# Altium schematic sheet XC2C128.SchDoc: FIT_PM12 board
size 420 x 297 mm; CheckedBy: G.Kasprowicz; Author: INR Moscow; CompanyName: WUT ISE; DrawnBy: M.Podgórski; Organization: WUT ISE; Address1: PW ISE; Address2: Nowowiejska 15/19 00-665 Warsaw; Address3: gkasprow@gmail.com; DocumentNumber: 7; Revision: 2; SheetNumber: 10; SheetTotal: 34; ModifiedBy: -; CheckedDate: -; Title2: CPLD; DivGrp: WUT ISE; Designer: INR RAS; ModifiedDate: -; ProjectName: Sensor Box
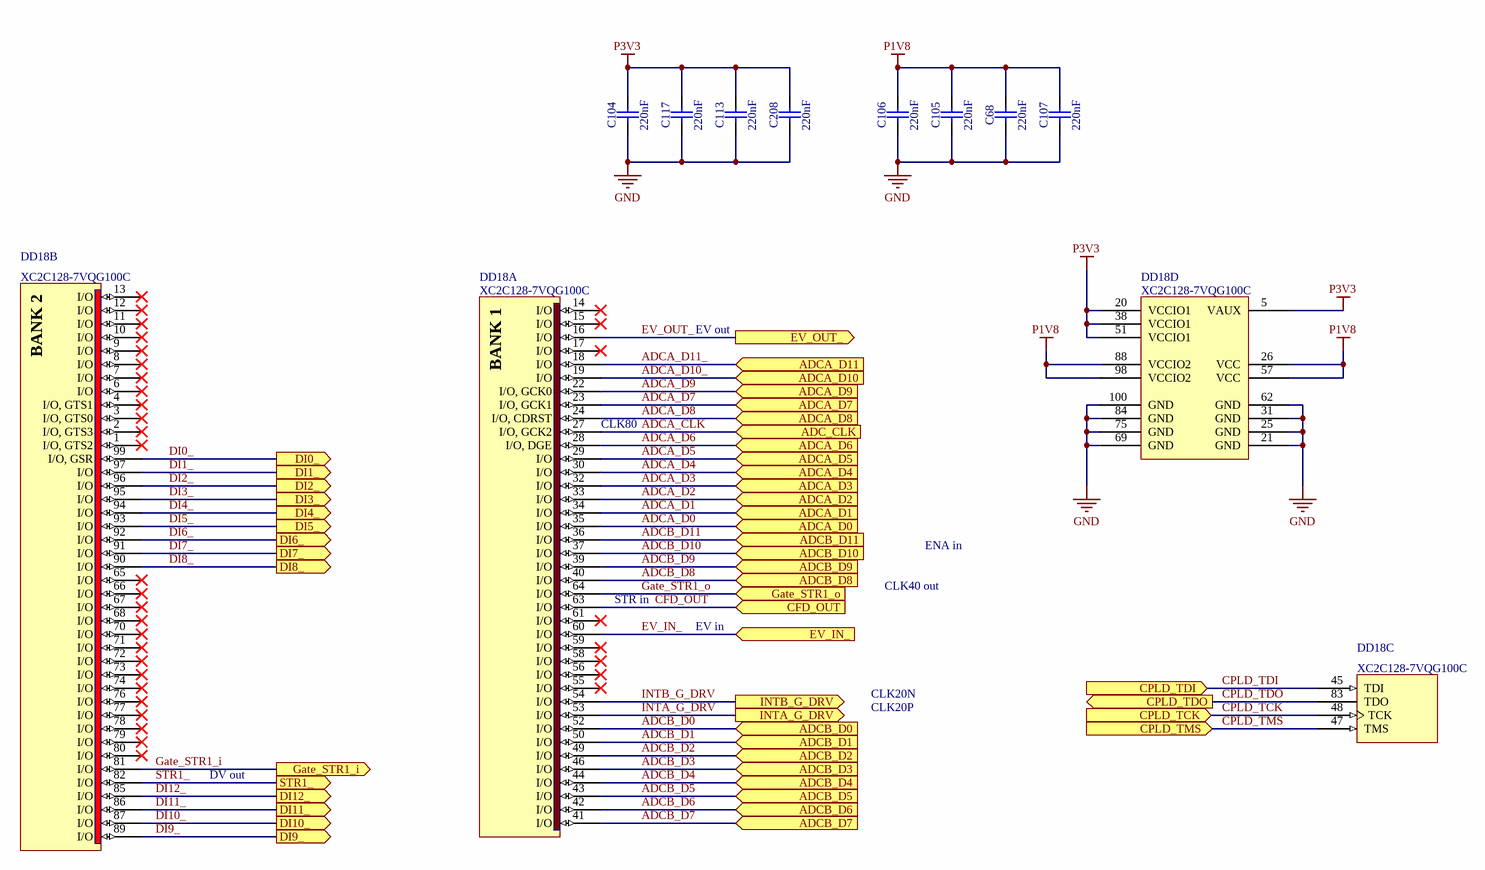
[diagram p0: XC2C128.SchDoc]

## Parts
C68  220nF  [CAPC2012X135N]
C104  220nF  [CAPC2012X135N]
C105  220nF  [CAPC2012X135N]
C106  220nF  [CAPC2012X135N]
C107  220nF  [CAPC2012X135N]
C113  220nF  [CAPC2012X135N]
C117  220nF  [CAPC2012X135N]
C208  220nF  [CAPC2012X135N]
DD18  XC2C128-7VQG100C  [QFP50P1600X1600X120-100N]  (parts A,B,C,D of 4)

## Ports
ADC_CLK (in), ADCA_D0 (in), ADCA_D1 (in), ADCA_D2 (in), ADCA_D3 (in), ADCA_D4 (in), ADCA_D5 (in), ADCA_D6 (in), ADCA_D7 (in), ADCA_D8 (in), ADCA_D9 (in), ADCA_D10 (in), ADCA_D11 (in), ADCB_D0 (in), ADCB_D1 (in), ADCB_D2 (in), ADCB_D3 (in), ADCB_D4 (in), ADCB_D5 (in), ADCB_D6 (in), ADCB_D7 (in), ADCB_D8 (in), ADCB_D9 (in), ADCB_D10 (in), ADCB_D11 (in), CFD_OUT (in), CPLD_TCK (in), CPLD_TDI (in), CPLD_TDO (out), CPLD_TMS (in), DI0_ (out), DI1_ (out), DI2_ (out), DI3_ (out), DI4_ (out), DI5_ (out), DI6_ (out), DI7_ (out), DI8_ (out), DI9_ (out), DI10_ (out), DI11_ (out), DI12_ (out), EV_IN_ (in), EV_OUT_ (out), Gate_STR1_i (out), Gate_STR1_o (in), INTA_G_DRV (out), INTB_G_DRV (out), STR1_ (out)

## Nets
GND: C68.1 C104.1 C105.1 C106.1 C107.1 C113.1 C117.1 C208.1 DD18.21(GND) DD18.25(GND) DD18.31(GND) DD18.62(GND) DD18.69(GND) DD18.75(GND) DD18.84(GND) DD18.100(GND)
P1V8: C68.2 C105.2 C106.2 C107.2 DD18.26(VCC) DD18.57(VCC) DD18.88(VCCIO2) DD18.98(VCCIO2)
P3V3: C104.2 C113.2 C117.2 C208.2 DD18.5(VAUX) DD18.20(VCCIO1) DD18.38(VCCIO1) DD18.51(VCCIO1)
ADCA_CLK: DD18.27(I/O,_GCK2) ; port ADC_CLK
ADCA_D0: DD18.35(I/O) ; port ADCA_D0
ADCA_D1: DD18.34(I/O) ; port ADCA_D1
ADCA_D2: DD18.33(I/O) ; port ADCA_D2
ADCA_D3: DD18.32(I/O) ; port ADCA_D3
ADCA_D4: DD18.30(I/O) ; port ADCA_D4
ADCA_D5: DD18.29(I/O) ; port ADCA_D5
ADCA_D6: DD18.28(I/O,_DGE) ; port ADCA_D6
ADCA_D7: DD18.23(I/O,_GCK1) ; port ADCA_D7
ADCA_D8: DD18.24(I/O,_CDRST) ; port ADCA_D8
ADCA_D9: DD18.22(I/O,_GCK0) ; port ADCA_D9
ADCA_D10_: DD18.19(I/O) ; port ADCA_D10
ADCA_D11_: DD18.18(I/O) ; port ADCA_D11
ADCB_D0: DD18.52(I/O) ; port ADCB_D0
ADCB_D1: DD18.50(I/O) ; port ADCB_D1
ADCB_D2: DD18.49(I/O) ; port ADCB_D2
ADCB_D3: DD18.46(I/O) ; port ADCB_D3
ADCB_D4: DD18.44(I/O) ; port ADCB_D4
ADCB_D5: DD18.43(I/O) ; port ADCB_D5
ADCB_D6: DD18.42(I/O) ; port ADCB_D6
ADCB_D7: DD18.41(I/O) ; port ADCB_D7
ADCB_D8: DD18.40(I/O) ; port ADCB_D8
ADCB_D9: DD18.39(I/O) ; port ADCB_D9
ADCB_D10: DD18.37(I/O) ; port ADCB_D10
ADCB_D11: DD18.36(I/O) ; port ADCB_D11
CFD_OUT: DD18.63(I/O) ; port CFD_OUT
CPLD_TCK: DD18.48(TCK) ; port CPLD_TCK
CPLD_TDI: DD18.45(TDI) ; port CPLD_TDI
CPLD_TDO: DD18.83(TDO) ; port CPLD_TDO
CPLD_TMS: DD18.47(TMS) ; port CPLD_TMS
DI0_: DD18.99(I/O,_GSR) ; port DI0_
DI1_: DD18.97(I/O) ; port DI1_
DI2_: DD18.96(I/O) ; port DI2_
DI3_: DD18.95(I/O) ; port DI3_
DI4_: DD18.94(I/O) ; port DI4_
DI5_: DD18.93(I/O) ; port DI5_
DI6_: DD18.92(I/O) ; port DI6_
DI7_: DD18.91(I/O) ; port DI7_
DI8_: DD18.90(I/O) ; port DI8_
DI9_: DD18.89(I/O) ; port DI9_
DI10_: DD18.87(I/O) ; port DI10_
DI11_: DD18.86(I/O) ; port DI11_
DI12_: DD18.85(I/O) ; port DI12_
EV_IN_: DD18.60(I/O) ; port EV_IN_
EV_OUT_: DD18.16(I/O) ; port EV_OUT_
Gate_STR1_i: DD18.81(I/O) ; port Gate_STR1_i
Gate_STR1_o: DD18.64(I/O) ; port Gate_STR1_o
INTA_G_DRV: DD18.53(I/O) ; port INTA_G_DRV
INTB_G_DRV: DD18.54(I/O) ; port INTB_G_DRV
STR1_: DD18.82(I/O) ; port STR1_

Not connected (* = marked no-connect by the designer): DD18 1(I/O,_GTS2)* 2(I/O,_GTS3)* 3(I/O,_GTS0)* 4(I/O,_GTS1)* 6(I/O)* 7(I/O)* 8(I/O)* 9(I/O)* 10(I/O)* 11(I/O)* 12(I/O)* 13(I/O)* 14(I/O)* 15(I/O)* 17(I/O)* 55(I/O)* 56(I/O)* 58(I/O)* 59(I/O)* 61(I/O)* 65(I/O)* 66(I/O)* 67(I/O)* 68(I/O)* 70(I/O)* 71(I/O)* 72(I/O)* 73(I/O)* 74(I/O)* 76(I/O)* 77(I/O)* 78(I/O)* 79(I/O)* 80(I/O)*

## Notes on the sheet
- EV out
- (near DD18) CLK80
- ENA in
- STR in
- EV in
- CLK40 out
- CLK20N
- DV out
- CLK20P
- Project/Equipment
- Document
- Designer
- Drawn by
- Check.by
- Copyright WUT ISE 2024.
  This documentation describes Open Hardware and is licensed under the CERN OHL v.2. You may redistribute and modify this documentation under the terms of the CERN OHL v.2. (http://ohwr.org/CERNOHL). This documentation is distributed WITHOUT ANY EXPRESS OR IMPLIED WARRANTY, INCLUDING OF MERCHANTABILITY, SATISFACTORY QUALITY AND FITNESS FOR A PARTICULAR PURPOSE. Please see the CERN OHL v.2 for applicable conditions.
- Contact
- File
- Last Mod.
- Print Date
- Sheet
- Size
- A3
- of
- Rev
- (in symbol XC2C128-7VQG100C, part A) BANK 1
- (in symbol XC2C128-7VQG100C, part B) BANK 2

## Library data of the parts
C68 C104-C107 C113 C117 C208 = CC0805_220NF_50V_10%_X7R: Non-polarised capacitor; Part Description: SMD Multilayer Chip Ceramic Capacitor; Manufacturer: GENERIC; Manufacturer1 Part Number: GRM21BR71H224KA01L; Voltage: 50V; TC: X7R; Tolerance: ±10%; Part Number: CC0805_220NF_50V_10%_X7R; Component Kind: Standard; Component Type: Standard; Pin Count: 2; Value: 220nF; Status: Preferred; Manufacturer Part Number: CC0805_220NF_50V_10%_X7R; Case: 0805; Mounted: Yes; Socket: No; SMD: Yes; Sense: No; Manufacturer1 Example: MURATA; Manufacturer1 ComponentHeight: 1.35mm; HelpURL: \\cern.ch\dfs\Applications\Altium\Datasheets\CC0805_X7R_MURATA.pdf; Author: CERN DEM JLC; CreateDate: 03.12.2007; LatestRevisionDate: 03.12.2007
DD18 = XC2C128-7VQG100C: CoolRunner-II 1.8V, 128 Macrocell CPLD, 80 User I/Os, 100-Pin VQFP, Commercial Grade, Pb-Free; Manufacturer: XILINX; PressFit: No; Bonding: No; Part Number: XC2C128-7VQG100C; Component Kind: Standard; Component Type: Standard; Device: XC2C128-7VQG100C; PackageDescription: QFP, 0.50mm Pitch, Square; 100 pin, 14.0mm L X 14.0mm W X 1.20mm H body, IPC Medium Density; Part Description: CoolRunner-II 1.8V, 128 Macrocell CPLD, 80 User I/Os, 100-Pin VQFP, Commercial Grade, Pb-Free; Manufacturer Part Number: XC2C128-7VQG100C; Pin Count: 100; Case: QFP100; Mounted: Yes; Socket: No; SMD: Yes; Sense: No; ComponentHeight: 1.2mm; HelpURL: \\cern.ch\dfs\Applications\Altium\Datasheets\XC2C128-7VQG100C.pdf; ComponentLink1URL: \\cern.ch\dfs\Applications\Altium\Datasheets\XC2C128-7VQG100C_Package.pdf; ComponentLink1Description: Package Drawing; Author: CERN DEM MR; CreateDate: 15.12.2015; LatestRevisionDate: 15.12.2015